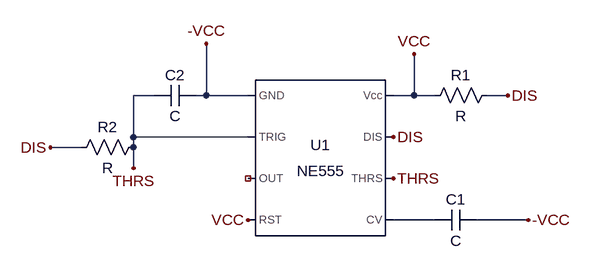
[diagram p0: schematic Draft1.asc]
Draft1.asc, the LTspice schematic file:
Version 4.1
SHEET 1 880 680
WIRE -160 96 -192 96
WIRE -80 96 -80 16
WIRE -80 96 -96 96
WIRE -16 96 -80 96
WIRE 240 96 240 32
WIRE 240 96 208 96
WIRE 272 96 240 96
WIRE 384 96 352 96
WIRE -192 160 -192 96
WIRE -16 160 -192 160
WIRE -272 176 -320 176
WIRE -192 176 -192 160
WIRE -192 208 -192 176
WIRE 272 288 208 288
WIRE 416 288 336 288
FLAG 208 160 DIS
FLAG 208 224 THRS
FLAG 416 288 -VCC
FLAG -16 288 VCC
FLAG 384 96 DIS
FLAG 240 32 VCC
FLAG -80 16 -VCC
FLAG -192 208 THRS
FLAG -320 176 DIS
SYMBOL Misc\\NE555 96 192 R0
SYMATTR InstName U1
SYMBOL cap 336 272 R90
WINDOW 0 0 32 VBottom 2
WINDOW 3 32 32 VTop 2
SYMATTR InstName C1
SYMBOL res 368 80 R90
WINDOW 0 0 56 VBottom 2
WINDOW 3 32 56 VTop 2
SYMATTR InstName R1
SYMBOL cap -96 80 R90
WINDOW 0 0 32 VBottom 2
WINDOW 3 32 32 VTop 2
SYMATTR InstName C2
SYMBOL res -176 160 R90
WINDOW 0 0 56 VBottom 2
WINDOW 3 32 56 VTop 2
SYMATTR InstName R2

The netlist it stands for:
* Draft1.asc
X§U1 -VCC THRS NC_01 VCC N001 THRS DIS VCC NE555  ; pins GND TRIG OUT RST CV THRS DIS Vcc
C1 -VCC N001 C
R1 DIS VCC R
C2 -VCC THRS C
R2 THRS DIS R
.lib NE555.sub
.backanno
.end